# Altium schematic sheet MD1-MRO1583D-50G-RoHS.schdoc
size A4; SheetNumber: 0; SheetTotal: 0
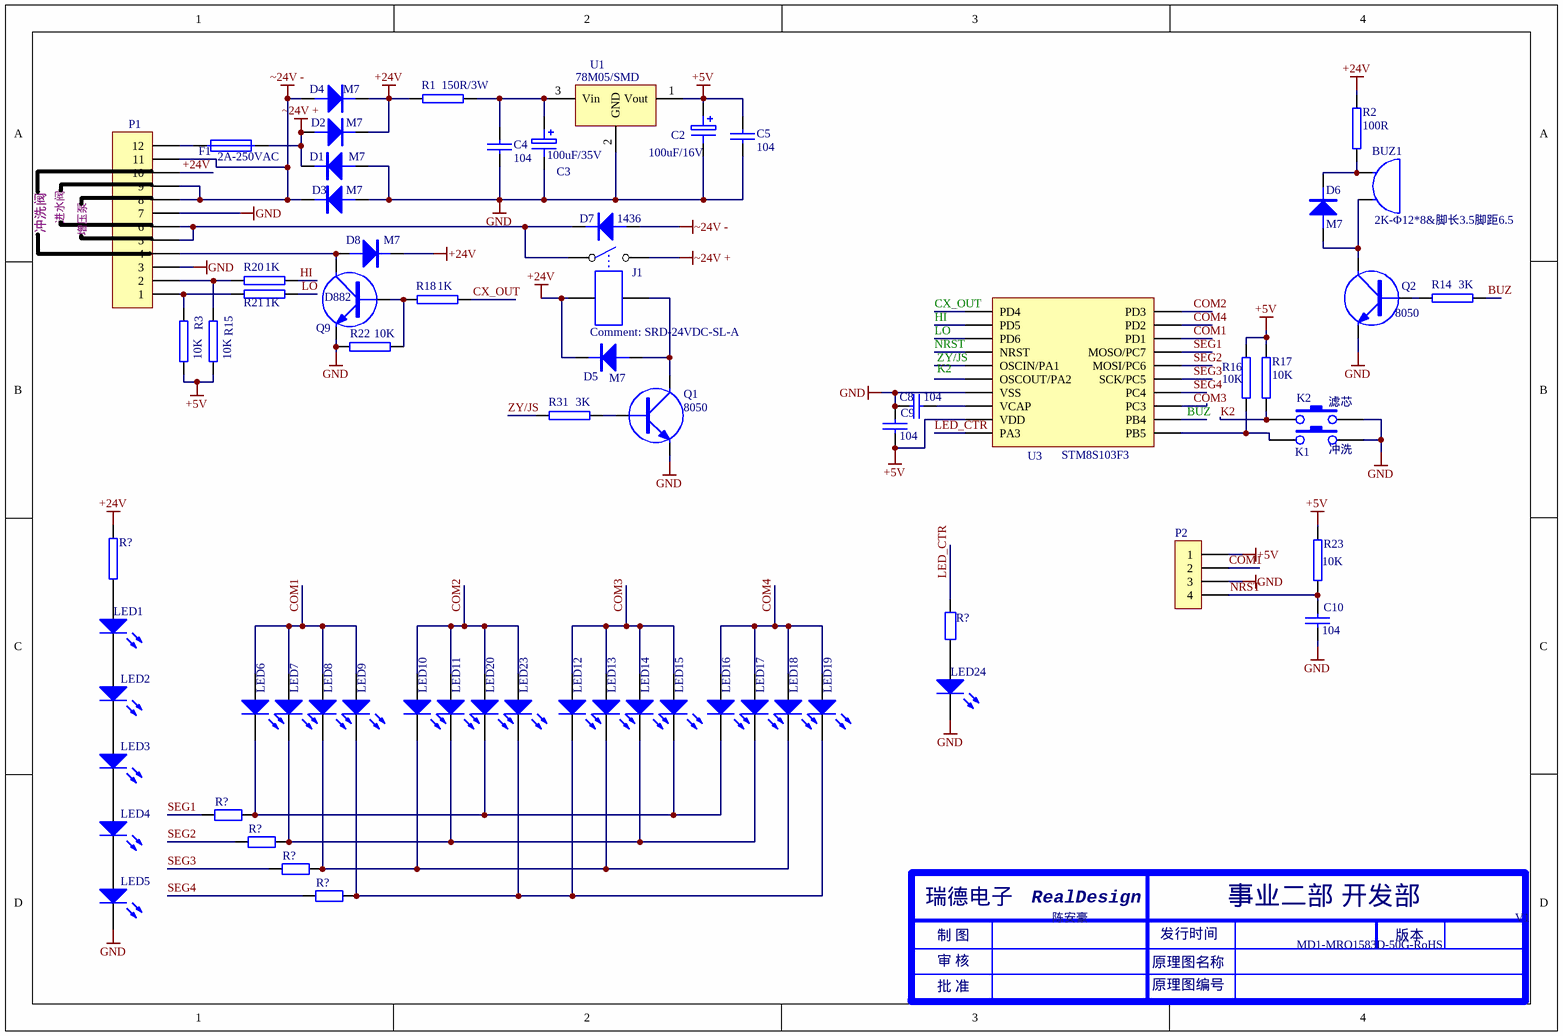
[diagram p0: MD1-MRO1583D-50G-RoHS.schdoc]

## Parts
(Parts that share a designator on the sheet are numbered #1, #2 ... from top to bottom, then left to right.)
BUZ1  2K-Φ12*8&脚长3.5脚距6.5  [BUZ4K-17MM]
C2  100uF/16V  [1000UF35V-1]
C3  100uF/35V  [1000UF35V-1]
C4  104  [0805c]
C5  104  [0805c]
C8  104  [0805c]
C9  104  [0805c]
C10  104  [0805c]
D1  M7  [4007]
D2  M7  [4007]
D3  M7  [4007]
D4  M7  [4007]
D5  M7  [4007]
D6  M7  [4007]
D7  1436  [4007]
D8  M7  [4007]
F1  2A-250VAC  [AXIAL-1W-V]
J1  SRD-24VDC-SL-A  [TRA2-L-24VDC]
K1  滤芯  [贴片按键]
K2  冲洗  [贴片按键]
LED1  (no value)  [DSO-F2/D6.1]
LED2  (no value)  [DSO-F2/D6.1]
LED3  (no value)  [DSO-F2/D6.1]
LED4  (no value)  [DSO-F2/D6.1]
LED5  (no value)  [DSO-F2/D6.1]
LED6  (no value)  [DSO-F2/D6.1]
LED7  (no value)  [DSO-F2/D6.1]
LED8  (no value)  [DSO-F2/D6.1]
LED9  (no value)  [DSO-F2/D6.1]
LED10  (no value)  [DSO-F2/D6.1]
LED11  (no value)  [DSO-F2/D6.1]
LED12  (no value)  [DSO-F2/D6.1]
LED13  (no value)  [DSO-F2/D6.1]
LED14  (no value)  [DSO-F2/D6.1]
LED15  (no value)  [DSO-F2/D6.1]
LED16  (no value)  [DSO-F2/D6.1]
LED17  (no value)  [DSO-F2/D6.1]
LED18  (no value)  [DSO-F2/D6.1]
LED19  (no value)  [DSO-F2/D6.1]
LED20  (no value)  [DSO-F2/D6.1]
LED23  (no value)  [DSO-F2/D6.1]
LED24  (no value)  [DSO-F2/D6.1]
P1  2.54  [xh-12a-1]  (value not drawn)
P2  (no value)  [SIP-4P]
Q1  8050  [sot-23-s-1]
Q2  8050  [sot-23-s-1]
Q9  D882  [sot-23-s-1]
R1  150R/3W  [0805R]
R2  100R  [0805R]
R3  10K  [0805R]
R14  3K  [0805R]
R15  10K  [0805R]
R16  10K  [0805R]
R17  10K  [0805R]
R18  1K  [0805R]
R20  1K  [0805R]
R21  1K  [0805R]
R22  10K  [0805R]
R23  10K  [0805R]
R31  3K  [0805R]
R?#1  (no value)  [0805R]
R?#2  Res2  [AXIAL-0.4]  (value not drawn)
R?#3  Res2  [AXIAL-0.4]  (value not drawn)
R?#4  Res2  [AXIAL-0.4]  (value not drawn)
R?#5  Res2  [AXIAL-0.4]  (value not drawn)
R?#6  Res2  [AXIAL-0.4]  (value not drawn)
U1  78M05/SMD  [SOT-89-(78L05)]
U3  STM8S103F3  [SSOP20]

## Nets
+5V: C2.1 C5.2 C9.1 P2.1 R3.1 R15.1 R16.1 R17.1 R23.1 U1.1(Vout) U3.9(VDD)
+24V: D2.K D3.K D5.K D8.K J1.3 P1.10 R1.1 R2.1 R?#1.2
GND: C2.2 C3.2 C4.1 C5.1 C8.2 C9.2 C10.1 D1.A D4.A K1.2 K2.2 LED5.2(K) LED24.2(K) P1.3 P1.7 P2.3 Q1.E Q2.E Q9.E R22.1 U1.2(GND) U3.7(VSS)
~24V +: D1.K D2.A F1.2 J1.2
~24V -: D3.A D4.K D7.A P1.8 P1.9 P1.11
BUZ: R14.2 U3.12(PB4)
COM1: LED6.1(A) LED7.1(A) LED8.1(A) LED9.1(A) P2.2 U3.18(PD1)
COM2: LED10.1(A) LED11.1(A) LED20.1(A) LED23.1(A) U3.20(PD3)
COM3: LED12.1(A) LED13.1(A) LED14.1(A) LED15.1(A) U3.13(PC3)
COM4: LED16.1(A) LED17.1(A) LED18.1(A) LED19.1(A) U3.19(PD2)
CX_OUT: R18.2 U3.1(PD4)
HI: R20.2 U3.2(PD5)
K2: K2.1 R17.2
LED_CTR: R?#2.2 U3.10(PA3)
LO: R21.2 U3.3(PD6)
NRST: C10.2 P2.4 R23.2 U3.4(NRST)
SEG1: R?#3.2 U3.17(MOSO/PC7)
SEG2: R?#4.2 U3.16(MOSI/PC6)
SEG3: R?#5.2 U3.15(SCK/PC5)
SEG4: R?#6.2 U3.14(PC4)
ZY/JS: R31.1 U3.5(OSCIN/PA1)
NetBUZ1_1: BUZ1.1(A) D6.K R2.2
NetBUZ1_2: BUZ1.2(B) D6.A Q2.C
NetC3_1: C3.1 C4.2 R1.2 U1.3(Vin)
NetC8_1: C8.1 U3.8(VCAP)
NetD5_A: D5.A J1.4 Q1.C
NetD7_K: D7.K J1.1 P1.5 P1.6
NetD8_A: D8.A P1.4 Q9.C
NetF1_1: F1.1 P1.12
NetK1_1: K1.1 R16.2 U3.11(PB5)
NetLED1_1: LED1.1(A) R?#1.1
NetLED1_2: LED1.2(K) LED2.1(A)
NetLED2_2: LED2.2(K) LED3.1(A)
NetLED3_2: LED3.2(K) LED4.1(A)
NetLED4_2: LED4.2(K) LED5.1(A)
NetLED6_2: LED6.2(K) LED15.2(K) LED16.2(K) LED20.2(K) R?#3.1
NetLED7_2: LED7.2(K) LED11.2(K) LED14.2(K) LED17.2(K) R?#4.1
NetLED8_2: LED8.2(K) LED10.2(K) LED13.2(K) LED18.2(K) R?#5.1
NetLED9_2: LED9.2(K) LED12.2(K) LED19.2(K) LED23.2(K) R?#6.1
NetLED24_1: LED24.1(A) R?#2.1
NetP1_1: P1.1 R3.2 R21.1
NetP1_2: P1.2 R15.2 R20.1
NetQ1_B: Q1.B R31.2
NetQ2_B: Q2.B R14.1
NetQ9_B: Q9.B R18.1 R22.2

Not connected (* = marked no-connect by the designer): U3 6(OSCOUT/PA2)

## Notes on the sheet
- 冲洗阀
- 进水阀
- 增压泵
- 陈安豪
- V1
- MD1-MRO1583D-50G-RoHS
- Labels drawn without touching a wire or pin: K2
- 瑞德电子
- RealDesign
- 事业二部 开发部
- 批 准
- 审 核
- 制 图
- 原理图编号
- 原理图名称
- 发行时间
- 版本

## Library data of the parts
BUZ1 = BUZZER
C2 C3 = ELECTRO1: Electrolytic Capacitor
C4 C5 C8-C10 = CAP: Capacitor
D1-D8 = DIODE
F1 = FUSE: 品号: *; 品名: *
J1 = RELAY-SPST
K1 K2 = SW-PB
LED1-LED20 LED23 LED24 = LED2: Typical RED, GREEN, YELLOW, AMBER GaAs LED; Published: 8-Jun-2000; LatestRevisionDate: 17-Jul-2002; LatestRevisionNote: Re-released for DXP Platform.; PackageVersion: Feb-2002; PackageReference: 3.2X1.6X1.1; Publisher: Altium Limited
P1 = CON12: Connector
P2 = CON4: Connector
Q1 Q2 Q9 = NPN: NPN Transistor
R1-R3 R14-R18 R20-R23 R31 R?#1 = R
R?#2-R?#6 = Res2: Resistor; Value: 1K; Published: 8-Jun-2000; LatestRevisionDate: 17-Jul-2002; LatestRevisionNote: Re-released for DXP Platform.; PackageReference: AXIAL-0.4; Publisher: Altium Limited
U1 = 78L05
U3 = CON AT36: 36 Pin AT Connector